# EAGLE schematic USB to UART CP2102 for ESP32 (EAGLE 9.6.2)
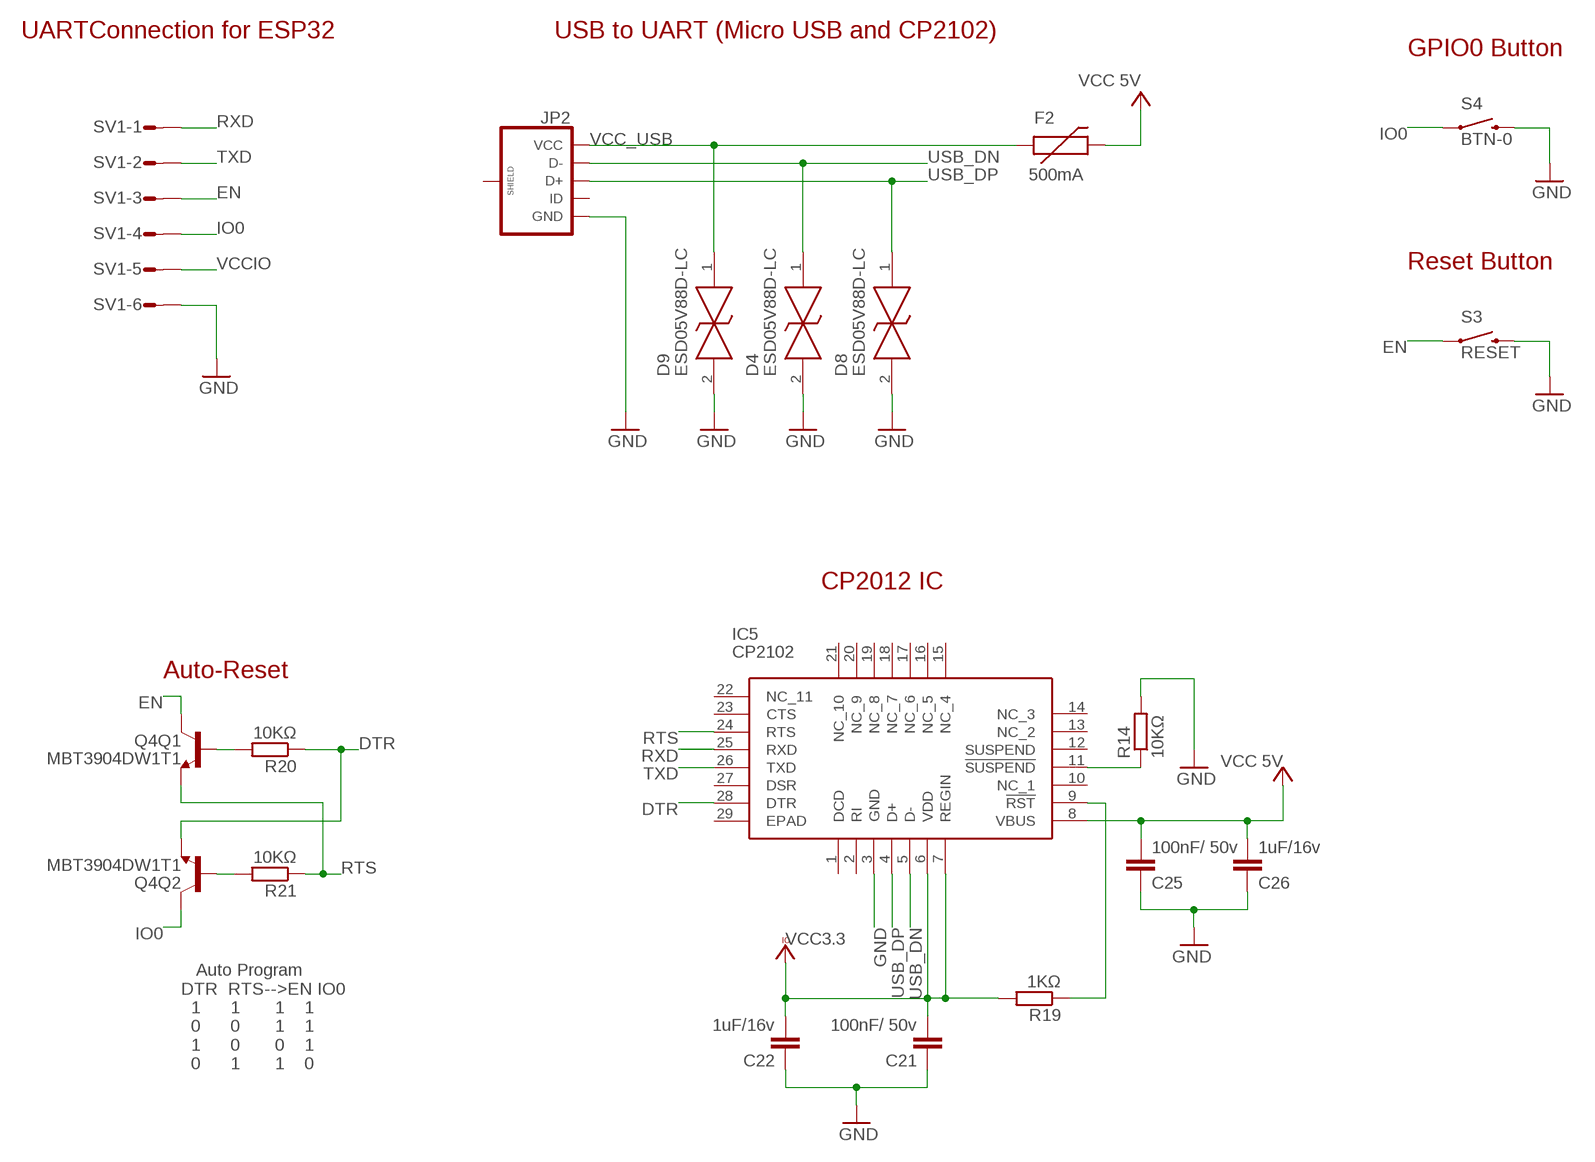
[diagram p0: schematic, sheet 1]

## Parts
C21  100nF/ 50v  C-EUC0603  [C0603]
C22  1uF/16v  C-EUC0603  [C0603]
C25  100nF/ 50v  C-EUC0603  [C0603]
C26  1uF/16v  C-EUC0603  [C0603]
D4  ESD05V88D-LC  [ESD05V88DLC]
D8  ESD05V88D-LC  [ESD05V88DLC]
D9  ESD05V88D-LC  [ESD05V88DLC]
F2  500mA  PTCSMD  [PTC-1206]
IC5  CP2102  [QFN50P500X500X100-29N]
JP2  USB_MICROB_PLUGCONN-11752  [USB-B-MICRO-SMD_V03]
Q4  MBT3904DW1T1  [SC70-6]
R14  10KΩ  R-EU_R0603  [R0603]
R19  1KΩ  R-EU_R0603  [R0603]
R20  10KΩ  R-EU_R0603  [R0603]
R21  10KΩ  R-EU_R0603  [R0603]
S3  RESET  SWITCH-MOMENTARY-2SMD-4.6X2.8MM  [TACTILE_SWITCH_SMD_4.6X2.8MM]
S4  BTN-0  SWITCH-MOMENTARY-2SMD-4.6X2.8MM  [TACTILE_SWITCH_SMD_4.6X2.8MM]
SV1  L06P  [L06P]

## Nets
ACTıVE: IC5.11(!SUSPEND) R14.1
DTR: IC5.28(DTR) Q4.1(Q2:E) R20.1
EN: Q4.3(Q1:C) S3.1 S3.2 SV1.3
GND: C21.1 C22.1 C25.1 C26.1 D4.2 D8.2 D9.2 IC5.3(GND) JP2.GND R14.2 S3.3 S3.4 S4.3 S4.4 SV1.6
IO0: Q4.6(Q2:C) S4.1 S4.2 SV1.4
N$17: Q4.5(Q1:B) R20.2
N$18: Q4.2(Q2:B) R21.2
N$24: IC5.9(!RST) R19.1
RTS: IC5.24(RTS) Q4.4(Q1:E) R21.1
RXD: IC5.25(RXD) SV1.1
TXD: IC5.26(TXD) SV1.2
USB_DN: D4.1 IC5.5(D-) JP2.D-
USB_DP: D8.1 IC5.4(D+) JP2.D+
VCC: C25.2 C26.2 F2.2 IC5.8(VBUS) ; supply symbol labelled VCC 5V
VCC_USB: D9.1 F2.1 JP2.VBUS(VCC)
VCCIO: C21.2 C22.2 IC5.6(VDD) IC5.7(REGIN) R19.2 SV1.5 ; supply symbol labelled VCC3.3
Unconnected: IC5.1(DCD) IC5.2(RI) IC5.10(NC_1) IC5.12(SUSPEND) IC5.13(NC_2) IC5.14(NC_3) IC5.15(NC_4) IC5.16(NC_5) IC5.17(NC_6) IC5.18(NC_7) IC5.19(NC_8) IC5.20(NC_9) IC5.21(NC_10) IC5.22(NC_11) IC5.23(CTS) IC5.27(DSR) IC5.29(EPAD) JP2.ID JP2.SHIELD1(SHIELD) JP2.SHIELD2(SHIELD) JP2.SHIELD3(SHIELD)

## Notes on the sheet
- UARTConnection for ESP32 | USB to UART (Micro USB and CP2102)
- GPIO0 Button
- Reset Button
- CP2012 IC
- Auto-Reset
- Auto Program
  DTR  RTS-->EN IO0
    1      1       1    1
    0      0       1    1
    1      0       0    1
    0      1       1    0

## Library data of the parts
C21 C22 C25 C26 = rcl:C-EU: CAPACITOR, European symbol; SPICEPREFIX: C
D4 D8 D9 = ESD05V88D-LC:ESD05V88D-LC: Bi-directional TVS Diode for ESD Protection Source: Datasheet <https://datasheet.lcsc.com/szlcsc/1902141130_SOCAY-Elec-ESD05V88D-LC_C303803.pdf>; DESCRIPTION: Bi-directional TVS Diode for ESD Protection; HEIGHT: 0.55mm; MANUFACTURER_NAME: SOCAY Elec; MANUFACTURER_PART_NUMBER: ESD05V88D-LC
F2 = SparkFun-PowerIC:PTC: Resettable Fuse PTC Resettable Fuse. Spark Fun Electronics SKU : COM-08357; PROD_ID: RES-11150
IC5 = CP2102:CP2102: USB Interface IC Source: Datasheet <https://componentsearchengine.com/Datasheets/1/CP2102.pdf>; DESCRIPTION: USB Interface IC; HEIGHT: 1mm; MANUFACTURER_NAME: Silicon Labs; MANUFACTURER_PART_NUMBER: CP2102; MOUSER_PART_NUMBER: 634-CP2102; MOUSER_PRICE-STOCK: https://www.mouser.co.uk/ProductDetail/Silicon-Labs/CP2102?qs=ucY0lxHzU7615lOm95XT0w%3D%3D
JP2 = SparkFun-Connectors:USB_MICROB_PLUG: USB Micro-B connectors Some male, some female. Watch your step!; PROD_ID: CONN-11752
Q4 = esp32-thing-temp:MBT3904DW1T1: MBT3904DW1 Dual NPN Transistors The MBT3904W1 puts two general purpose 3904 NPN transistors in a single package. Datasheet <http://www.onsemi.com/pub_link/Collateral/MBT3904DW1T1-D.PDF>; PROD_ID: TRANS-13337
R14 R19-R21 = rcl:R-EU_: RESISTOR, European symbol; SPICEPREFIX: R
S3 S4 = SparkFun-Electromechanical:SWITCH-MOMENTARY-2: Various NO switches- pushbuttons, reed, etc; PROD_ID: SWCH-13065
SV1 = con-amp-mt:L06P: AMP MT CONNECTOR; OC_FARNELL: unknown; OC_NEWARK: unknown